# Altium schematic sheet Sheet1.SchDoc
size 381 x 241 mm; SheetNumber: 1; SheetTotal: 1
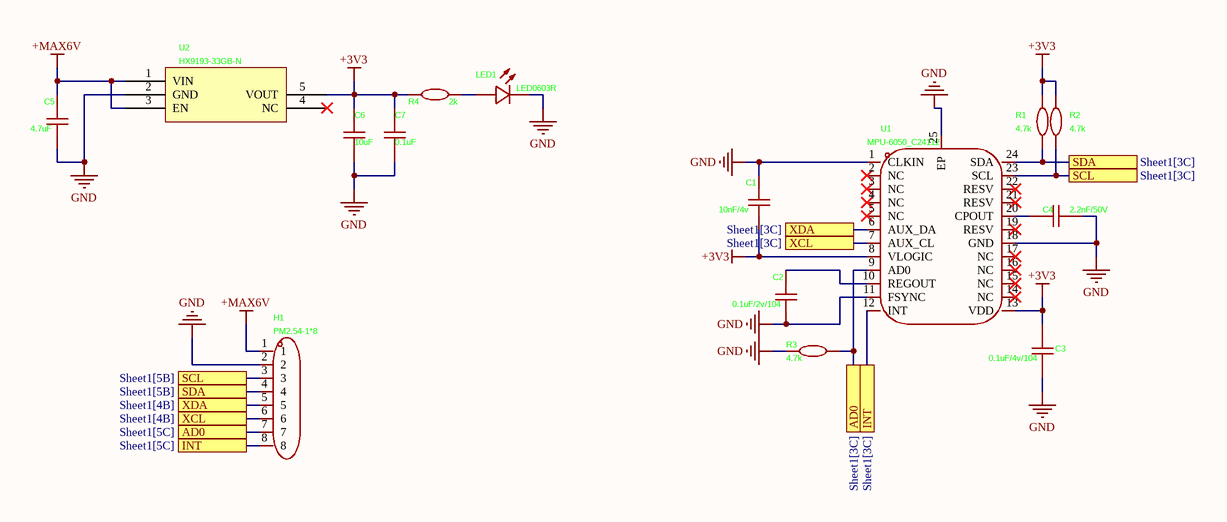
[diagram p0: Sheet1.SchDoc]

## Parts
C1  10nF/4v  [C0402]
C2  0.1uF/2v/104  [C0402]
C3  0.1uF/4v/104  [C0402]
C4  2.2nF/50V  [C0402]
C5  4.7uF  [C0402]
C6  10uF  [C0402]
C7  0.1uF  [C0402]
H1  PM2.54-1*8  [HDR-TH_8P-P2.54-V-F]
LED1  LED0603R  [LED0603-FD]
R1  4.7k  [R0603]
R2  4.7k  [R0603]
R3  4.7k  [R0603]
R4  2k  [R0603]
U1  MPU-6050_C24112  [QFN-24_L4.0-W4.0-P0.50-BL-EP2.7]
U2  HX9193-33GB-N  [SOT-23-5_L2.9-W1.6-P0.95-LS2.8-BL]

## Ports
AD0 (see Sheet1[3C]), AD0 (see Sheet1[5C]), INT (see Sheet1[3C]), INT (see Sheet1[5C]), SCL (see Sheet1[3C]), SCL (see Sheet1[5B]), SDA (see Sheet1[3C]), SDA (see Sheet1[5B]), XCL (see Sheet1[3C]), XCL (see Sheet1[4B]), XDA (see Sheet1[3C]), XDA (see Sheet1[4B])

## Nets
+3V3: C1.1 C3.2 C6.2 C7.2 R1.2 R2.2 R4.1 U1.8(VLOGIC) U1.13(VDD) U2.5(VOUT)
+MAX6V: C5.2 H1.1 U2.1(VIN) U2.3(EN)
GND: C1.2 C2.1 C3.1 C4.2 C5.1 C6.1 C7.1 H1.2 LED1.2(-) R3.1 U1.1(CLKIN) U1.11(FSYNC) U1.18(GND) U1.25(EP) U2.2(GND)
AD0: H1.7 R3.2 U1.9(AD0) ; port AD0
INT: H1.8 U1.12(INT) ; port INT
SCL: H1.3 R2.1 U1.23(SCL) ; port SCL
SDA: H1.4 R1.1 U1.24(SDA) ; port SDA
XCL: H1.6 U1.7(AUX_CL) ; port XCL
XDA: H1.5 U1.6(AUX_DA) ; port XDA
NetC2_2: C2.2 U1.10(REGOUT)
NetC4_1: C4.1 U1.20(CPOUT)
NetLED1_1: LED1.1(+) R4.2

Not connected (* = marked no-connect by the designer): U1 2(NC)* 3(NC)* 4(NC)* 5(NC)* 14(NC)* 15(NC)* 16(NC)* 17(NC)* 19(RESV)* 21(RESV)* 22(RESV)*; U2 4(NC)*

## Library data of the parts
C1-C7 = GRM1555C1H180JA01D: Manufacturer: muRata(村田); Add into BOM: yes; Value: 18pF; Tolerance: ±5%; Symbol: GRM1555C1H180JA01D; Device: GRM1555C1H180JA01D; LCSC Part Name: 18pF ±5% 50V; Supplier Part: C33149; Manufacturer Part: GRM1555C1H180JA01D; Supplier Footprint: 0402; JLCPCB Part Class: Extended Part; Datasheet: https://atta.szlcsc.com/upload/public/pdf/source/20161108/1478586362936.pdf; Supplier: LCSC; Convert to PCB: yes
H1 = PM2.54-1*8: Manufacturer: ZHOURI(洲日); Add into BOM: yes; Holes Structure: 1x8P; Pitch: 2.54mm; Circular Hole / Square Hole: 方孔; Number of Holes: 8P; Current Rating (Max): 2.5A; Holes Direction: Top; Symbol: PM2.54-1*8; Device: PM2.54-1*8; LCSC Part Name: 间距:2.54mm 1x8P 直插; Supplier Part: C5224027; Manufacturer Part: PM2.54-1*8; Supplier Footprint: 插件,P=2.54mm; JLCPCB Part Class: Extended Part; Datasheet: https://atta.szlcsc.com/upload/public/pdf/source/20221031/E5BAE727A502DC7C69CE947E807E2296.pdf; Supplier: LCSC; Convert to PCB: yes; Row Spacing: 2.54mm; Mounting Type: Straight; Number of Rows: Plugin; Insulation Height: 8.5mm; Operating Temperature Range: -40℃~+105℃
LED1 = YLED0603R: Manufacturer: YONGYUTAI(永裕泰); Add into BOM: yes; Emitted Color: Red; Forward Voltage (VF): 1.8V~2.4V; Forward Current: 25mA; Dominant Wavelength: 620nm~625nm; Symbol: YLED0603R; Device: YLED0603R; LCSC Part Name: YLED0603R; Supplier Part: C19171390; Manufacturer Part: YLED0603R; Supplier Footprint: 0603; JLCPCB Part Class: Extended Part; Datasheet: https://atta.szlcsc.com/upload/public/pdf/source/20231027/FB19AF06E2C70028E58AB5CEDD1BDC72.pdf; Supplier: LCSC; Convert to PCB: yes; Power Dissipation: -; Peak Wavelength: -; Diode Configuration: -; Lens Color: -; Color Temperature: -; Luminous Intensity: -; Viewing Angle: -; Mounting Sytle: -; Operating Temperature: -40℃~+85℃
R1-R4 = RC0603FR-0710KL: Manufacturer: YAGEO(国巨); Add into BOM: yes; Value: 10kΩ; Tolerance: ±1%; Temperature Coefficient: ±100ppm/℃; Symbol: RC0603FR-0710KL; Device: RC0603FR-0710KL; LCSC Part Name: 厚膜电阻 10kΩ ±1% 100mW; Supplier Part: C98220; Manufacturer Part: RC0603FR-0710KL; Supplier Footprint: 0603; JLCPCB Part Class: Extended Part; Datasheet: https://atta.szlcsc.com/upload/public/pdf/source/20180927/C295883_E8D83085EA81BD7DE0B2B681138C15EE.pdf; Supplier: LCSC; Convert to PCB: yes; Type: Thick Film Resistors; Operating Temperature Range: -55℃~+155℃
U1 = MPU-6050: Manufacturer: TDK InvenSense(应美盛); Add into BOM: yes; Sensor Type: 加速度计陀螺仪; Symbol: MPU-6050_C24112; Device: MPU-6050; LCSC Part Name: MPU-6050; Supplier Part: C24112; Manufacturer Part: MPU-6050; Supplier Footprint: QFN-24-EP(4x4); JLCPCB Part Class: Extended Part; Datasheet: https://atta.szlcsc.com/upload/public/pdf/source/20140425/1457707046159.pdf; Supplier: LCSC; Convert to PCB: yes; Operating Temperature: -40℃~+85℃
U2 = HX9193-33GB-N: Manufacturer: HX(恒佳兴); Add into BOM: yes; Output Voltage: 3.3V; Output Current: 300mA; Symbol: HX9193-33GB-N; Device: HX9193-33GB-N; LCSC Part Name: HX9193-33GB-N; Supplier Part: C2995655; Manufacturer Part: HX9193-33GB-N; Supplier Footprint: SOT-23-5; JLCPCB Part Class: Extended Part; Datasheet: https://atta.szlcsc.com/upload/public/pdf/source/20220412/18D9B33FD58646224E88440BBF52FED7.pdf; Supplier: LCSC; Convert to PCB: yes; Output Type: -; Voltage - Supply: -; Power Supply Rejection Ratio (PSRR): -; Voltage Dropout: -; standby current: -; Noise: -; Features: Low ESR；Overcurrent Protection(OCP)；With ability; Operating Temperature: -; Output Configuration: -; Number of Outputs: -